# Altium schematic sheet STM32F407开发板1.SchDoc
size A3
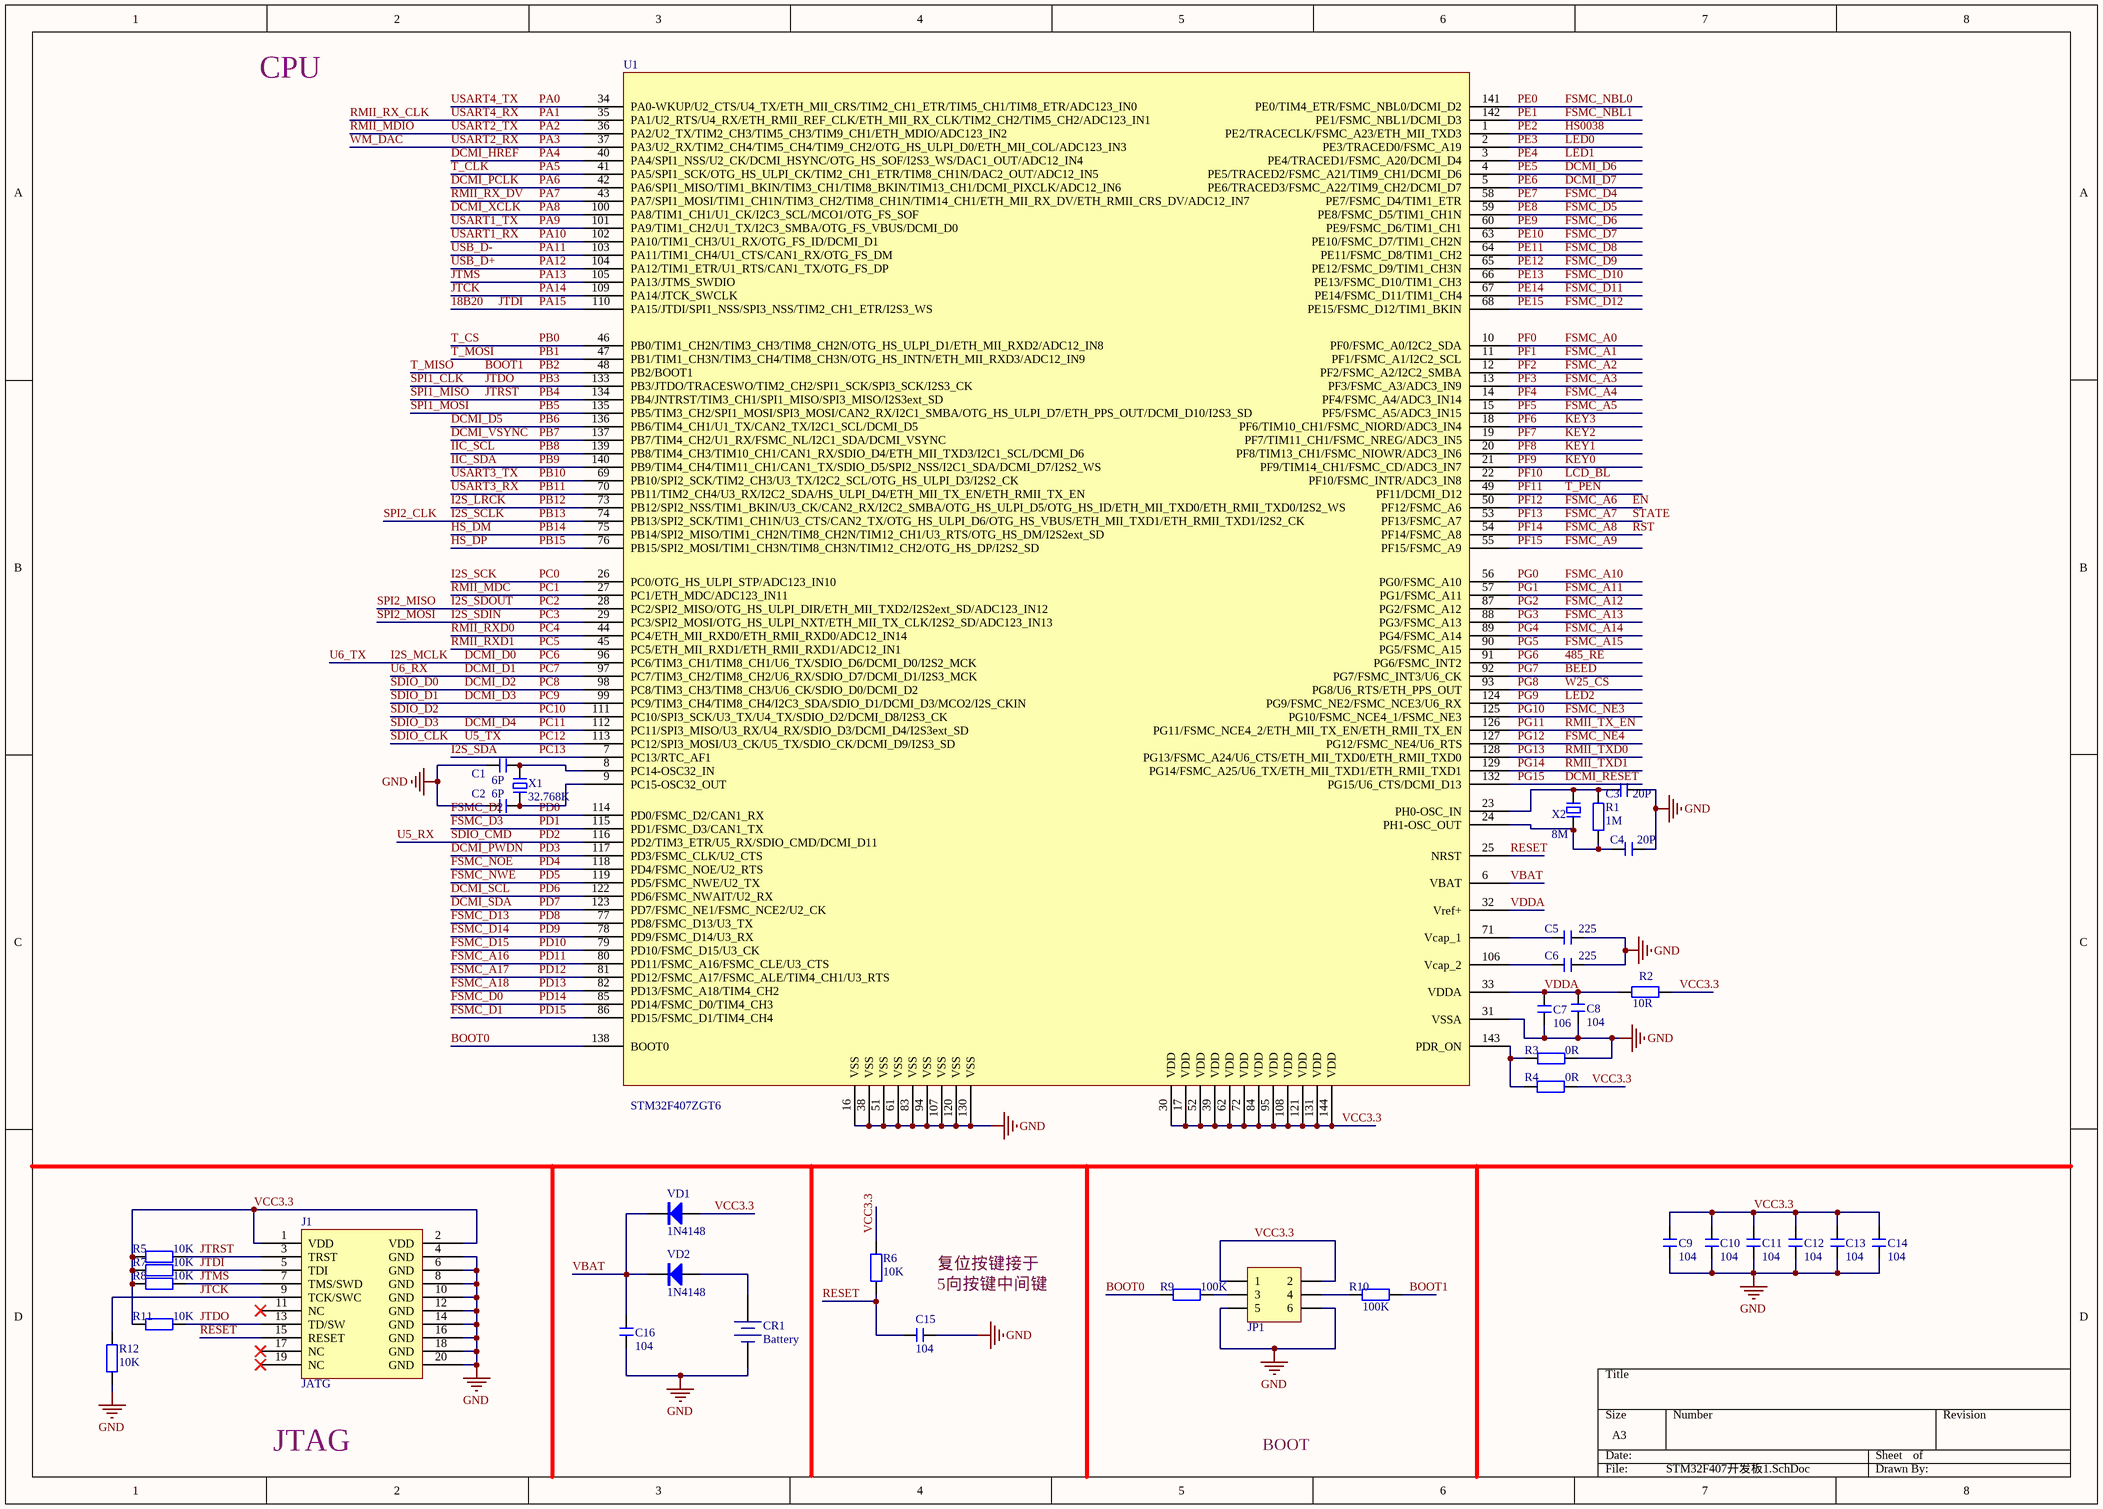
[diagram p0: STM32F407开发板1.SchDoc]

## Parts
C1  6P  [C 0603]
C2  6P  [C 0603]
C3  20P  [C 0603]
C4  20P  [C 0603]
C5  225  [C 0603]
C6  225  [C 0603]
C7  106  [C 0603]
C8  104  [C 0603]
C9  104  [C 0603]
C10  104  [C 0603]
C11  104  [C 0603]
C12  104  [C 0603]
C13  104  [C 0603]
C14  104  [C 0603]
C15  104  [C 0603]
C16  104  [C 0603]
CR1  Battery  [CR1220_A]
J1  JATG  [HDR-10X2]
JP1  Header3X2  [HDR-3X2]  (value not drawn)
R1  1M  [R 0603]
R2  10R  [R 0603]
R3  0R  [R 0603]
R4  0R  [R 0603]
R5  10K  [R 0603]
R6  10K  [R 0603]
R7  10K  [R 0603]
R8  10K  [R 0603]
R9  100K  [R 0603]
R10  100K  [R 0603]
R11  10K  [R 0603]
R12  10K  [R 0603]
U1  STM32F407ZGT6  [TQFP144 20x20_L]
VD1  1N4148  [MINI_MELF (LL34)]
VD2  1N4148  [MINI_MELF (LL34)]
X1  32.768K  [XTAL-4S8]
X2  8M  [XTAL-49S SMD]

## Nets
GND: C1.1 C2.1 C3.1 C4.1 C5.1 C6.1 C7.1 C8.1 C9.1 C10.1 C11.1 C12.1 C13.1 C14.1 C15.1 C16.1 CR1.DC- J1.4(GND) J1.6(GND) J1.8(GND) J1.10(GND) J1.12(GND) J1.14(GND) J1.16(GND) J1.18(GND) J1.20(GND) JP1.5 JP1.6 R3.2 R12.1 U1.16(VSS) U1.31(VSSA) U1.38(VSS) U1.51(VSS) U1.61(VSS) U1.83(VSS) U1.94(VSS) U1.107(VSS) U1.120(VSS) U1.130(VSS)
18B20: J1.5(TDI) R7.2 U1.110(PA15/JTDI/SPI1_NSS/SPI3_NSS/TIM2_CH1_ETR/I2S3_WS)  [also labelled JTDI, PA15]
485_RE: U1.91(PG6/FSMC_INT2)  [also labelled PG6]
BEED: U1.92(PG7/FSMC_INT3/U6_CK)  [also labelled PG7]
BOOT0: R9.1 U1.138(BOOT0)
BOOT1: R10.2 U1.48(PB2/BOOT1)  [also labelled PB2, T_MISO]
DCMI_D0: U1.96(PC6/TIM3_CH1/TIM8_CH1/U6_TX/SDIO_D6/DCMI_D0/I2S2_MCK)  [also labelled I2S_MCLK, PC6, U6_TX]
DCMI_D1: U1.97(PC7/TIM3_CH2/TIM8_CH2/U6_RX/SDIO_D7/DCMI_D1/I2S3_MCK)  [also labelled PC7, U6_RX]
DCMI_D2: U1.98(PC8/TIM3_CH3/TIM8_CH3/U6_CK/SDIO_D0/DCMI_D2)  [also labelled PC8, SDIO_D0]
DCMI_D3: U1.99(PC9/TIM3_CH4/TIM8_CH4/I2C3_SDA/SDIO_D1/DCMI_D3/MCO2/I2S_CKIN)  [also labelled PC9, SDIO_D1]
DCMI_D4: U1.112(PC11/SPI3_MISO/U3_RX/U4_RX/SDIO_D3/DCMI_D4/I2S3ext_SD)  [also labelled PC11, SDIO_D3]
DCMI_D5: U1.136(PB6/TIM4_CH1/U1_TX/CAN2_TX/I2C1_SCL/DCMI_D5)  [also labelled PB6]
DCMI_D6: U1.4(PE5/TRACED2/FSMC_A21/TIM9_CH1/DCMI_D6)  [also labelled PE5]
DCMI_D7: U1.5(PE6/TRACED3/FSMC_A22/TIM9_CH2/DCMI_D7)  [also labelled PE6]
DCMI_HREF: U1.40(PA4/SPI1_NSS/U2_CK/DCMI_HSYNC/OTG_HS_SOF/I2S3_WS/DAC1_OUT/ADC12_IN4)  [also labelled PA4]
DCMI_PCLK: U1.42(PA6/SPI1_MISO/TIM1_BKIN/TIM3_CH1/TIM8_BKIN/TIM13_CH1/DCMI_PIXCLK/ADC12_IN6)  [also labelled PA6]
DCMI_PWDN: U1.117(PD3/FSMC_CLK/U2_CTS)  [also labelled PD3]
DCMI_RESET: U1.132(PG15/U6_CTS/DCMI_D13)  [also labelled PG15]
DCMI_SCL: U1.122(PD6/FSMC_NWAIT/U2_RX)  [also labelled PD6]
DCMI_SDA: U1.123(PD7/FSMC_NE1/FSMC_NCE2/U2_CK)  [also labelled PD7]
DCMI_VSYNC: U1.137(PB7/TIM4_CH2/U1_RX/FSMC_NL/I2C1_SDA/DCMI_VSYNC)  [also labelled PB7]
DCMI_XCLK: U1.100(PA8/TIM1_CH1/U1_CK/I2C3_SCL/MCO1/OTG_FS_SOF)  [also labelled PA8]
EN: U1.50(PF12/FSMC_A6)  [also labelled FSMC_A6, PF12]
FSMC_A0: U1.10(PF0/FSMC_A0/I2C2_SDA)  [also labelled PF0]
FSMC_A1: U1.11(PF1/FSMC_A1/I2C2_SCL)  [also labelled PF1]
FSMC_A2: U1.12(PF2/FSMC_A2/I2C2_SMBA)  [also labelled PF2]
FSMC_A3: U1.13(PF3/FSMC_A3/ADC3_IN9)  [also labelled PF3]
FSMC_A4: U1.14(PF4/FSMC_A4/ADC3_IN14)  [also labelled PF4]
FSMC_A5: U1.15(PF5/FSMC_A5/ADC3_IN15)  [also labelled PF5]
FSMC_A7: U1.53(PF13/FSMC_A7)  [also labelled PF13, STATE]
FSMC_A8: U1.54(PF14/FSMC_A8)  [also labelled PF14, RST]
FSMC_A9: U1.55(PF15/FSMC_A9)  [also labelled PF15]
FSMC_A10: U1.56(PG0/FSMC_A10)  [also labelled PG0]
FSMC_A11: U1.57(PG1/FSMC_A11)  [also labelled PG1]
FSMC_A12: U1.87(PG2/FSMC_A12)  [also labelled PG2]
FSMC_A13: U1.88(PG3/FSMC_A13)  [also labelled PG3]
FSMC_A14: U1.89(PG4/FSMC_A14)  [also labelled PG4]
FSMC_A15: U1.90(PG5/FSMC_A15)  [also labelled PG5]
FSMC_A16: U1.80(PD11/FSMC_A16/FSMC_CLE/U3_CTS)  [also labelled PD11]
FSMC_A17: U1.81(PD12/FSMC_A17/FSMC_ALE/TIM4_CH1/U3_RTS)  [also labelled PD12]
FSMC_A18: U1.82(PD13/FSMC_A18/TIM4_CH2)  [also labelled PD13]
FSMC_D0: U1.85(PD14/FSMC_D0/TIM4_CH3)  [also labelled PD14]
FSMC_D1: U1.86(PD15/FSMC_D1/TIM4_CH4)  [also labelled PD15]
FSMC_D2: U1.114(PD0/FSMC_D2/CAN1_RX)  [also labelled PD0]
FSMC_D3: U1.115(PD1/FSMC_D3/CAN1_TX)  [also labelled PD1]
FSMC_D4: U1.58(PE7/FSMC_D4/TIM1_ETR)  [also labelled PE7]
FSMC_D5: U1.59(PE8/FSMC_D5/TIM1_CH1N)  [also labelled PE8]
FSMC_D6: U1.60(PE9/FSMC_D6/TIM1_CH1)  [also labelled PE9]
FSMC_D7: U1.63(PE10/FSMC_D7/TIM1_CH2N)  [also labelled PE10]
FSMC_D8: U1.64(PE11/FSMC_D8/TIM1_CH2)  [also labelled PE11]
FSMC_D9: U1.65(PE12/FSMC_D9/TIM1_CH3N)  [also labelled PE12]
FSMC_D10: U1.66(PE13/FSMC_D10/TIM1_CH3)  [also labelled PE13]
FSMC_D11: U1.67(PE14/FSMC_D11/TIM1_CH4)  [also labelled PE14]
FSMC_D12: U1.68(PE15/FSMC_D12/TIM1_BKIN)  [also labelled PE15]
FSMC_D13: U1.77(PD8/FSMC_D13/U3_TX)  [also labelled PD8]
FSMC_D14: U1.78(PD9/FSMC_D14/U3_RX)  [also labelled PD9]
FSMC_D15: U1.79(PD10/FSMC_D15/U3_CK)  [also labelled PD10]
FSMC_NBL0: U1.141(PE0/TIM4_ETR/FSMC_NBL0/DCMI_D2)  [also labelled PE0]
FSMC_NBL1: U1.142(PE1/FSMC_NBL1/DCMI_D3)  [also labelled PE1]
FSMC_NE3: U1.125(PG10/FSMC_NCE4_1/FSMC_NE3)  [also labelled PG10]
FSMC_NE4: U1.127(PG12/FSMC_NE4/U6_RTS)  [also labelled PG12]
FSMC_NOE: U1.118(PD4/FSMC_NOE/U2_RTS)  [also labelled PD4]
FSMC_NWE: U1.119(PD5/FSMC_NWE/U2_TX)  [also labelled PD5]
HS0038: U1.1(PE2/TRACECLK/FSMC_A23/ETH_MII_TXD3)  [also labelled PE2]
HS_DM: U1.75(PB14/SPI2_MISO/TIM1_CH2N/TIM8_CH2N/TIM12_CH1/U3_RTS/OTG_HS_DM/I2S2ext_SD)  [also labelled PB14]
HS_DP: U1.76(PB15/SPI2_MOSI/TIM1_CH3N/TIM8_CH3N/TIM12_CH2/OTG_HS_DP/I2S2_SD)  [also labelled PB15]
I2S_LRCK: U1.73(PB12/SPI2_NSS/TIM1_BKIN/U3_CK/CAN2_RX/I2C2_SMBA/OTG_HS_ULPI_D5/OTG_HS_ID/ETH_MII_TXD0/ETH_RMII_TXD0/I2S2_WS)  [also labelled PB12]
I2S_SCK: U1.26(PC0/OTG_HS_ULPI_STP/ADC123_IN10)  [also labelled PC0]
I2S_SCLK: U1.74(PB13/SPI2_SCK/TIM1_CH1N/U3_CTS/CAN2_TX/OTG_HS_ULPI_D6/OTG_HS_VBUS/ETH_MII_TXD1/ETH_RMII_TXD1/I2S2_CK)  [also labelled PB13, SPI2_CLK]
I2S_SDA: U1.7(PC13/RTC_AF1)  [also labelled PC13]
I2S_SDIN: U1.29(PC3/SPI2_MOSI/OTG_HS_ULPI_NXT/ETH_MII_TX_CLK/I2S2_SD/ADC123_IN13)  [also labelled PC3, SPI2_MOSI]
I2S_SDOUT: U1.28(PC2/SPI2_MISO/OTG_HS_ULPI_DIR/ETH_MII_TXD2/I2S2ext_SD/ADC123_IN12)  [also labelled PC2, SPI2_MISO]
IIC_SCL: U1.139(PB8/TIM4_CH3/TIM10_CH1/CAN1_RX/SDIO_D4/ETH_MII_TXD3/I2C1_SCL/DCMI_D6)  [also labelled PB8]
IIC_SDA: U1.140(PB9/TIM4_CH4/TIM11_CH1/CAN1_TX/SDIO_D5/SPI2_NSS/I2C1_SDA/DCMI_D7/I2S2_WS)  [also labelled PB9]
JTCK: J1.9(TCK/SWC) R12.2 U1.109(PA14/JTCK_SWCLK)  [also labelled PA14]
JTDO: J1.13(TD/SW) R11.2 U1.133(PB3/JTDO/TRACESWO/TIM2_CH2/SPI1_SCK/SPI3_SCK/I2S3_CK)  [also labelled PB3, SPI1_CLK]
JTMS: J1.7(TMS/SWD) R8.2 U1.105(PA13/JTMS_SWDIO)  [also labelled PA13]
JTRST: J1.3(TRST) R5.2 U1.134(PB4/JNTRST/TIM3_CH1/SPI1_MISO/SPI3_MISO/I2S3ext_SD)  [also labelled PB4, SPI1_MISO]
KEY0: U1.21(PF9/TIM14_CH1/FSMC_CD/ADC3_IN7)  [also labelled PF9]
KEY1: U1.20(PF8/TIM13_CH1/FSMC_NIOWR/ADC3_IN6)  [also labelled PF8]
KEY2: U1.19(PF7/TIM11_CH1/FSMC_NREG/ADC3_IN5)  [also labelled PF7]
KEY3: U1.18(PF6/TIM10_CH1/FSMC_NIORD/ADC3_IN4)  [also labelled PF6]
LCD_BL: U1.22(PF10/FSMC_INTR/ADC3_IN8)  [also labelled PF10]
LED0: U1.2(PE3/TRACED0/FSMC_A19)  [also labelled PE3]
LED1: U1.3(PE4/TRACED1/FSMC_A20/DCMI_D4)  [also labelled PE4]
LED2: U1.124(PG9/FSMC_NE2/FSMC_NCE3/U6_RX)  [also labelled PG9]
PA0: U1.34(PA0-WKUP/U2_CTS/U4_TX/ETH_MII_CRS/TIM2_CH1_ETR/TIM5_CH1/TIM8_ETR/ADC123_IN0)  [also labelled USART4_TX]
PA1: U1.35(PA1/U2_RTS/U4_RX/ETH_RMII_REF_CLK/ETH_MII_RX_CLK/TIM2_CH2/TIM5_CH2/ADC123_IN1)  [also labelled RMII_RX_CLK, USART4_RX]
PA2: U1.36(PA2/U2_TX/TIM2_CH3/TIM5_CH3/TIM9_CH1/ETH_MDIO/ADC123_IN2)  [also labelled RMII_MDIO, USART2_TX]
PA3: U1.37(PA3/U2_RX/TIM2_CH4/TIM5_CH4/TIM9_CH2/OTG_HS_ULPI_D0/ETH_MII_COL/ADC123_IN3)  [also labelled USART2_RX, WM_DAC]
PA5: U1.41(PA5/SPI1_SCK/OTG_HS_ULPI_CK/TIM2_CH1_ETR/TIM8_CH1N/DAC2_OUT/ADC12_IN5)  [also labelled T_CLK]
PA7: U1.43(PA7/SPI1_MOSI/TIM1_CH1N/TIM3_CH2/TIM8_CH1N/TIM14_CH1/ETH_MII_RX_DV/ETH_RMII_CRS_DV/ADC12_IN7)  [also labelled RMII_RX_DV]
PA9: U1.101(PA9/TIM1_CH2/U1_TX/I2C3_SMBA/OTG_FS_VBUS/DCMI_D0)  [also labelled USART1_TX]
PA10: U1.102(PA10/TIM1_CH3/U1_RX/OTG_FS_ID/DCMI_D1)  [also labelled USART1_RX]
PA11: U1.103(PA11/TIM1_CH4/U1_CTS/CAN1_RX/OTG_FS_DM)  [also labelled USB_D-]
PA12: U1.104(PA12/TIM1_ETR/U1_RTS/CAN1_TX/OTG_FS_DP)  [also labelled USB_D+]
PB0: U1.46(PB0/TIM1_CH2N/TIM3_CH3/TIM8_CH2N/OTG_HS_ULPI_D1/ETH_MII_RXD2/ADC12_IN8)  [also labelled T_CS]
PB1: U1.47(PB1/TIM1_CH3N/TIM3_CH4/TIM8_CH3N/OTG_HS_INTN/ETH_MII_RXD3/ADC12_IN9)  [also labelled T_MOSI]
PB5: U1.135(PB5/TIM3_CH2/SPI1_MOSI/SPI3_MOSI/CAN2_RX/I2C1_SMBA/OTG_HS_ULPI_D7/ETH_PPS_OUT/DCMI_D10/I2S3_SD)  [also labelled SPI1_MOSI]
PB10: U1.69(PB10/SPI2_SCK/TIM2_CH3/U3_TX/I2C2_SCL/OTG_HS_ULPI_D3/I2S2_CK)  [also labelled USART3_TX]
PB11: U1.70(PB11/TIM2_CH4/U3_RX/I2C2_SDA/HS_ULPI_D4/ETH_MII_TX_EN/ETH_RMII_TX_EN)  [also labelled USART3_RX]
PC1: U1.27(PC1/ETH_MDC/ADC123_IN11)  [also labelled RMII_MDC]
PC4: U1.44(PC4/ETH_MII_RXD0/ETH_RMII_RXD0/ADC12_IN14)  [also labelled RMII_RXD0]
PC5: U1.45(PC5/ETH_MII_RXD1/ETH_RMII_RXD1/ADC12_IN1)  [also labelled RMII_RXD1]
PC10: U1.111(PC10/SPI3_SCK/U3_TX/U4_TX/SDIO_D2/DCMI_D8/I2S3_CK)  [also labelled SDIO_D2]
PC12: U1.113(PC12/SPI3_MOSI/U3_CK/U5_TX/SDIO_CK/DCMI_D9/I2S3_SD)  [also labelled SDIO_CLK, U5_TX]
PD2: U1.116(PD2/TIM3_ETR/U5_RX/SDIO_CMD/DCMI_D11)  [also labelled SDIO_CMD, U5_RX]
PF11: U1.49(PF11/DCMI_D12)  [also labelled T_PEN]
PG8: U1.93(PG8/U6_RTS/ETH_PPS_OUT)  [also labelled W25_CS]
PG11: U1.126(PG11/FSMC_NCE4_2/ETH_MII_TX_EN/ETH_RMII_TX_EN)  [also labelled RMII_TX_EN]
PG13: U1.128(PG13/FSMC_A24/U6_CTS/ETH_MII_TXD0/ETH_RMII_TXD0)  [also labelled RMII_TXD0]
PG14: U1.129(PG14/FSMC_A25/U6_TX/ETH_MII_TXD1/ETH_RMII_TXD1)  [also labelled RMII_TXD1]
RESET: C15.2 J1.15(RESET) R6.1 U1.25(NRST)
VBAT: C16.2 U1.6(VBAT) VD1.2(K) VD2.2(K)
VCC3.3: C9.2 C10.2 C11.2 C12.2 C13.2 C14.2 J1.1(VDD) J1.2(VDD) JP1.1 JP1.2 R2.2 R4.2 R5.1 R6.2 R7.1 R8.1 R11.1 U1.17(VDD) U1.30(VDD) U1.39(VDD) U1.52(VDD) U1.62(VDD) U1.72(VDD) U1.84(VDD) U1.95(VDD) U1.108(VDD) U1.121(VDD) U1.131(VDD) U1.144(VDD) VD1.1(A)
VDDA: C7.2 C8.2 R2.1 U1.32(Vref+) U1.33(VDDA)
NetC1_2: C1.2 U1.8(PC14-OSC32_IN) X1.2
NetC2_2: C2.2 U1.9(PC15-OSC32_OUT) X1.1
NetC3_2: C3.2 R1.2 U1.23(PH0-OSC_IN) X2.1
NetC4_2: C4.2 R1.1 U1.24(PH1-OSC_OUT) X2.2
NetC5_2: C5.2 U1.71(Vcap_1)
NetC6_2: C6.2 U1.106(Vcap_2)
NetCR1_DC+: CR1.DC+ VD2.1(A)
NetJP1_3: JP1.3 R9.2
NetJP1_4: JP1.4 R10.1
NetR3_1: R3.1 R4.1 U1.143(PDR_ON)

Not connected (* = marked no-connect by the designer): J1 11(NC)* 17(NC)* 19(NC)*

## Notes on the sheet
- CPU
- 复位按键接于
- 5向按键中间键
- JTAG
- BOOT

## Library data of the parts
C1-C16 = C: 无极性贴片电容; 版权归属: 源创客; BOM名称: 无极性贴片电容; 学习资源: www.ooocke.com
CR1 = CR-3V: 微型电池; 版权归属: 源创客; BOM名称: 微型电池; 学习资源: www.ooocke.com
JP1 = Header 3X2: 3*2P接插件; 版权归属: 源创客; BOM名称: 3*2P接插件; 学习资源: www.ooocke.com
R1-R12 = R: 贴片电阻; 版权归属: 源创客; BOM名称: 贴片电阻; 学习资源: www.ooocke.com
VD1 VD2 = 1N4148: 高速开关二极管; 版权归属: 源创客; BOM名称: 高速开关二极管; 学习资源: www.ooocke.com
X1 X2 = XTAL-2: 2脚晶振; 版权归属: 源创客; BOM名称: 2脚晶振; 学习资源: www.ooocke.com